# Altium schematic sheet E17-04-PRECHARGE-DISCHARGE.SchDoc
size A; DocumentNumber: 7; SheetNumber: 7; SheetTotal: 18
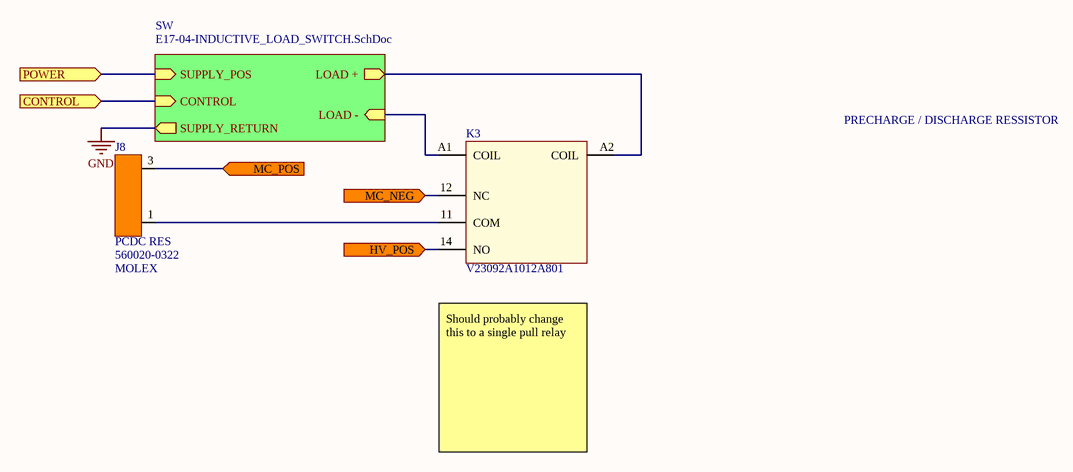
[diagram p0: E17-04-PRECHARGE-DISCHARGE.SchDoc]

## Parts
J8  PCDC RES  MPN: 560020-0322  MANUFACTURER: MOLEX  [MOLEX_DURACLIK_3 RED - VERT  HV]
K3  V23092A1012A801  [SCHRACK]

## Sub-sheets
SW = E17-04-INDUCTIVE_LOAD_SWITCH.SchDoc: CONTROL (in), LOAD + (out), SUPPLY_POS (in), LOAD - (in), SUPPLY_RETURN (out)

## Ports
CONTROL (in), HV_POS (in), MC_NEG (in), MC_POS (in), POWER (in)

## Nets
GND: sheet SW/SUPPLY_RETURN
CONTROL: port CONTROL, sheet SW/CONTROL
HV_POS: K3.14(NO) ; port HV_POS
MC_NEG: K3.12(NC) ; port MC_NEG
MC_POS: J8.3 ; port MC_POS
POWER: port POWER, sheet SW/SUPPLY_POS
NetJ8_1: J8.1 K3.11(COM)
NetK3_A1: K3.A1(COIL) ; sheet SW/LOAD -
NetK3_A2: K3.A2(COIL) ; sheet SW/LOAD +

## Notes on the sheet
- PRECHARGE / DISCHARGE RESSISTOR
- Should probably change this to a single pull relay

## Library data of the parts
J8 = 560020-0322_HV: MOLEX DURACLIK 3-PIN VERT RED HV; POSITIONS: 2; PLATING: Tin (Sn); CURRENT: 3; VOLTAGE: 250; UL: 94V-0; Digikey_PN: Not in production; COLOR: RED; SERIES: Duraclik; ORIENTATOIN: VERT; Comment_1: 560020-0322_HV
K3 = V23092A1012A801: 12V slim SPDT Relay; MFG: TE; DC Contact Voltage: 300; Coil Voltage: 12; Coil Current: 0.0142; DIGIKEY_PN: PB2044-ND; Supplier 1: Digikey; Supplier Part Number 1: PB2044-ND; MFG_PN: V23092A1012A801